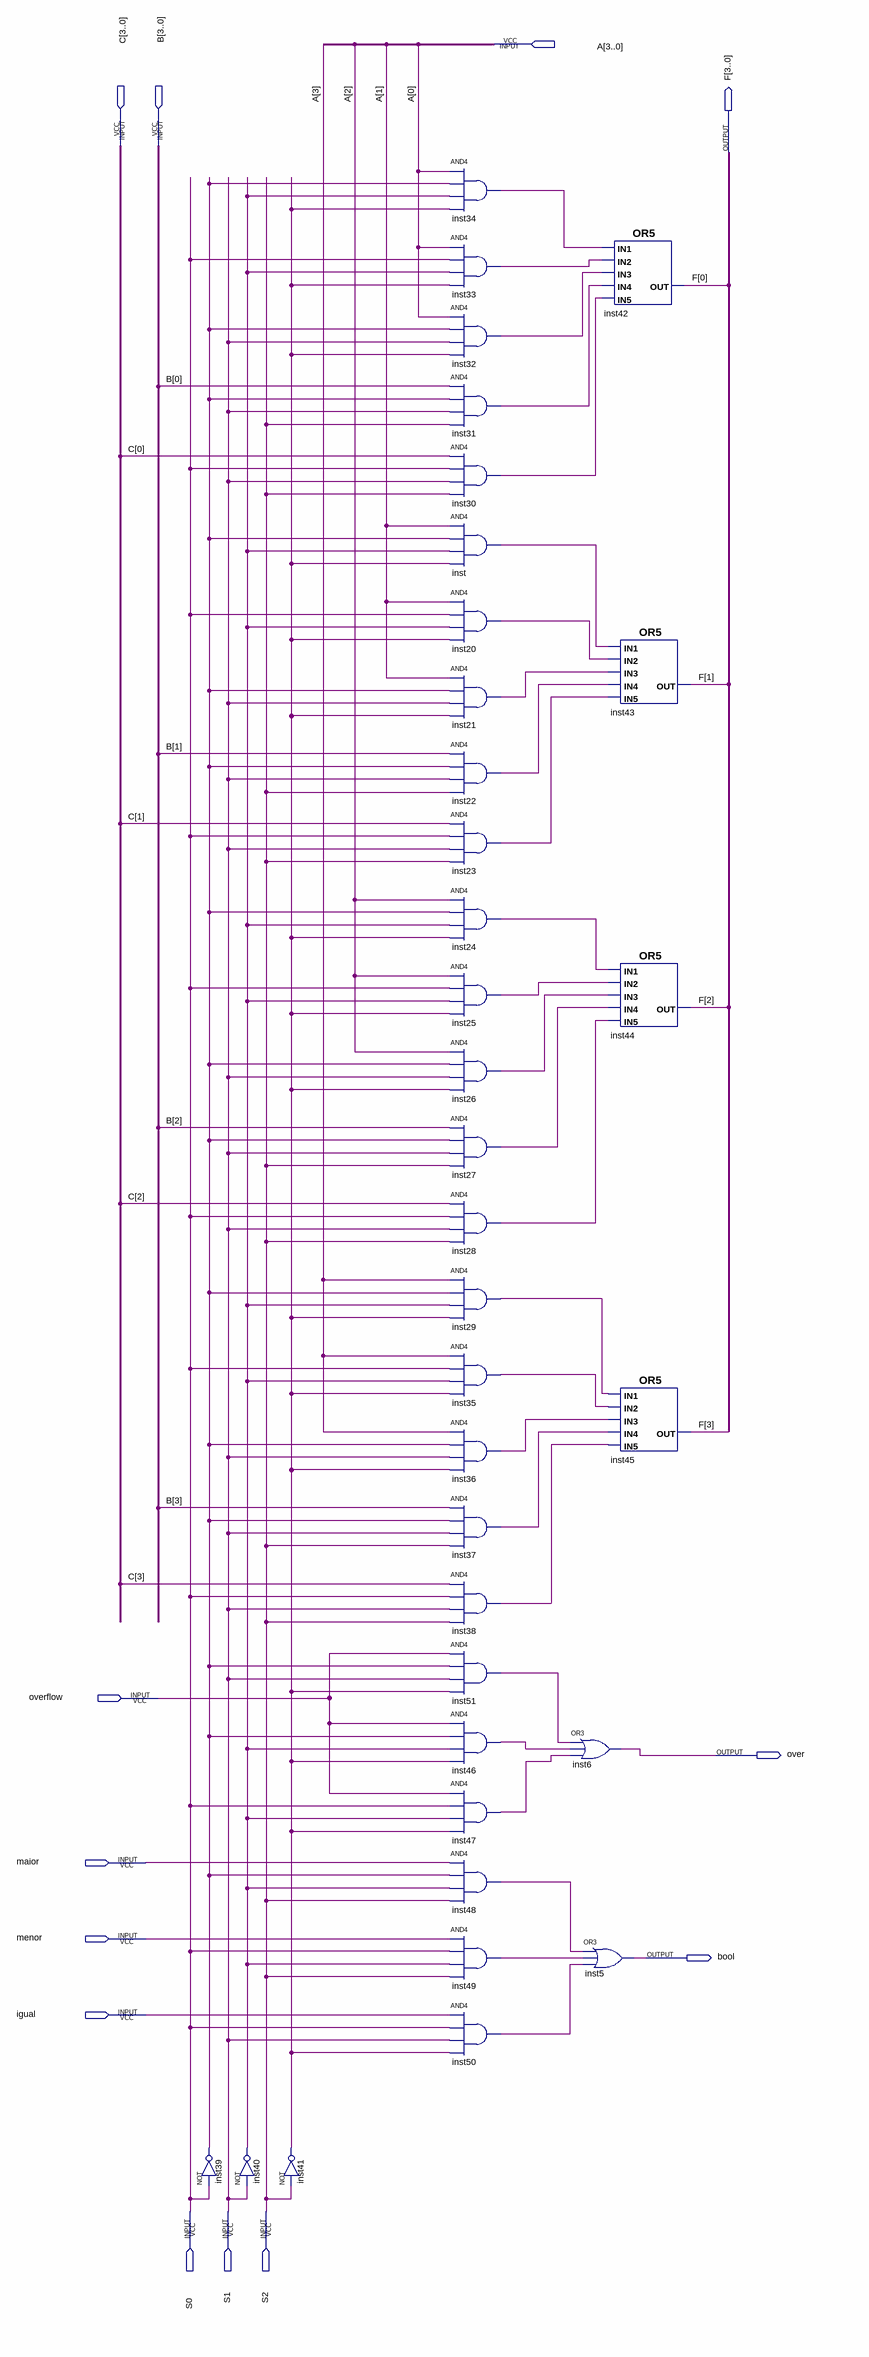
[diagram p0: schematic sheet]
// Quartus schematic mucsi.bdf as structural Verilog: 35 symbols, 13 pins
module mucsi (
  input  [3:0] A,
  input  [3:0] C,
  input  [3:0] B,
  input  overflow,
  input  maior,
  input  menor,
  input  igual,
  input  S0,
  input  S1,
  input  S2,
  output [3:0] F,
  output over,
  output \bool 
);

  wire inst20_out, inst21_out, inst22_out, inst23_out, inst24_out, inst25_out, inst26_out, inst27_out,
       inst28_out, inst29_out, inst30_out, inst31_out, inst32_out, inst33_out, inst34_out, inst35_out,
       inst36_out, inst37_out, inst38_out, inst39_out, inst40_out, inst41_out, inst46_out, inst47_out,
       inst48_out, inst49_out, inst50_out, inst51_out, inst_out;

  not inst39 (inst39_out, S0);
  not inst40 (inst40_out, S1);
  not inst41 (inst41_out, S2);
  and inst34 (inst34_out, A[0], inst39_out, inst40_out, inst41_out);
  and inst33 (inst33_out, A[0], S0, inst40_out, inst41_out);
  and inst32 (inst32_out, A[0], inst39_out, S1, inst41_out);
  and inst31 (inst31_out, B[0], inst39_out, S1, S2);
  and inst30 (inst30_out, C[0], S0, S1, S2);
  and inst (inst_out, A[1], inst39_out, inst40_out, inst41_out);
  and inst20 (inst20_out, A[1], S0, inst40_out, inst41_out);
  and inst21 (inst21_out, A[1], inst39_out, S1, inst41_out);
  and inst22 (inst22_out, B[1], inst39_out, S1, S2);
  and inst23 (inst23_out, C[1], S0, S1, S2);
  and inst24 (inst24_out, A[2], inst39_out, inst40_out, inst41_out);
  and inst25 (inst25_out, A[2], S0, inst40_out, inst41_out);
  and inst26 (inst26_out, A[2], inst39_out, S1, inst41_out);
  and inst27 (inst27_out, B[2], inst39_out, S1, S2);
  and inst28 (inst28_out, C[2], S0, S1, S2);
  and inst29 (inst29_out, A[3], inst39_out, inst40_out, inst41_out);
  and inst35 (inst35_out, A[3], S0, inst40_out, inst41_out);
  and inst36 (inst36_out, A[3], inst39_out, S1, inst41_out);
  and inst37 (inst37_out, B[3], inst39_out, S1, S2);
  and inst38 (inst38_out, C[3], S0, S1, S2);
  and inst51 (inst51_out, overflow, inst39_out, S1, inst41_out);
  and inst46 (inst46_out, overflow, inst39_out, inst40_out, inst41_out);
  and inst47 (inst47_out, overflow, S0, inst40_out, inst41_out);
  and inst48 (inst48_out, maior, inst39_out, inst40_out, S2);
  and inst49 (inst49_out, menor, S0, inst40_out, S2);
  and inst50 (inst50_out, igual, S0, S1, inst41_out);
  or inst6 (over, inst51_out, inst46_out, inst47_out);
  or inst5 (\bool , inst48_out, inst49_out, inst50_out);
  or inst42 (F[0], inst34_out, inst33_out, inst32_out, inst31_out, inst30_out);
  or inst43 (F[1], inst_out, inst20_out, inst21_out, inst22_out, inst23_out);
  or inst44 (F[2], inst24_out, inst25_out, inst26_out, inst27_out, inst28_out);
  or inst45 (F[3], inst29_out, inst35_out, inst36_out, inst37_out, inst38_out);
endmodule
